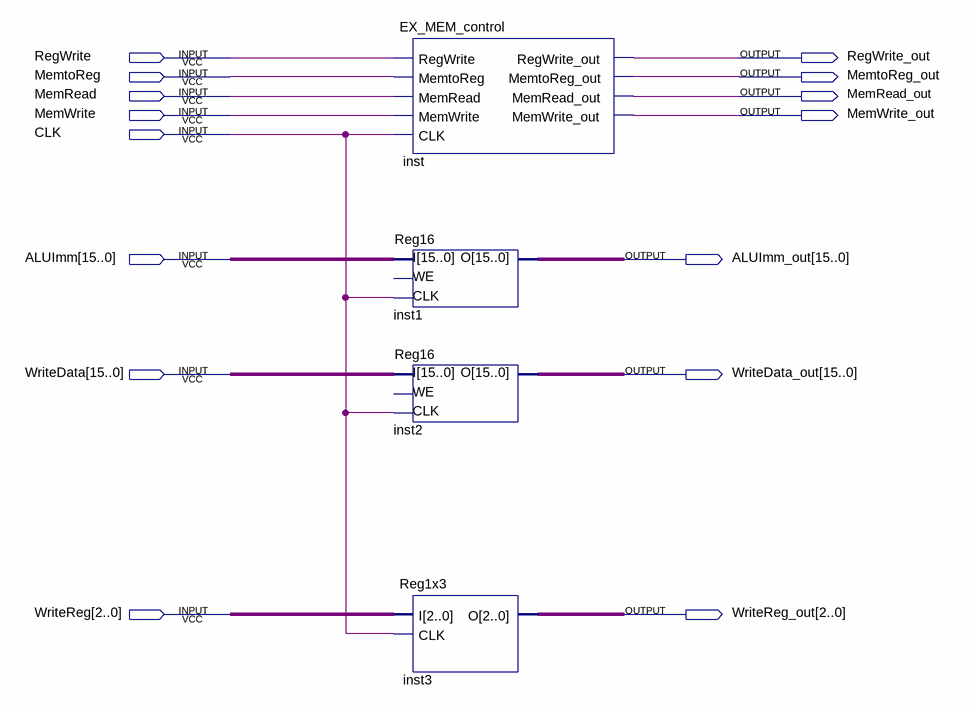
[diagram p0: schematic sheet]
// Quartus schematic EX_MEM.bdf as structural Verilog: 4 symbols, 15 pins
module EX_MEM (
  input  RegWrite,
  input  MemtoReg,
  input  MemRead,
  input  MemWrite,
  input  CLK,
  input  [15:0] ALUImm,
  input  [15:0] WriteData,
  input  [2:0] WriteReg,
  output RegWrite_out,
  output MemtoReg_out,
  output MemRead_out,
  output MemWrite_out,
  output [15:0] ALUImm_out,
  output [15:0] WriteData_out,
  output [2:0] WriteReg_out
);

  EX_MEM_control inst (
    .RegWrite(RegWrite), .MemtoReg(MemtoReg), .MemRead(MemRead), .MemWrite(MemWrite), .CLK(CLK),
    .RegWrite_out(RegWrite_out), .MemtoReg_out(MemtoReg_out), .MemRead_out(MemRead_out),
    .MemWrite_out(MemWrite_out));
  Reg16 inst1 (.CLK(CLK), .I(ALUImm), .O(ALUImm_out));  // open: WE
  Reg16 inst2 (.CLK(CLK), .I(WriteData), .O(WriteData_out));  // open: WE
  Reg1x3 inst3 (.I(WriteReg), .CLK(CLK), .O(WriteReg_out));
endmodule
